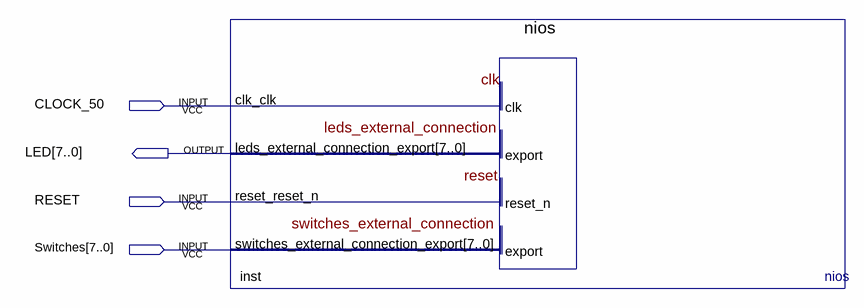
[diagram p0: schematic sheet]
// Quartus schematic Nios_Lab.bdf as structural Verilog: 1 symbols, 4 pins
module Nios_Lab (
  input  CLOCK_50,
  input  RESET,
  input  [7:0] Switches,
  output [7:0] LED
);

  nios inst (
    .clk_clk(CLOCK_50), .reset_reset_n(RESET), .switches_external_connection_export(Switches),
    .leds_external_connection_export(LED));
endmodule
